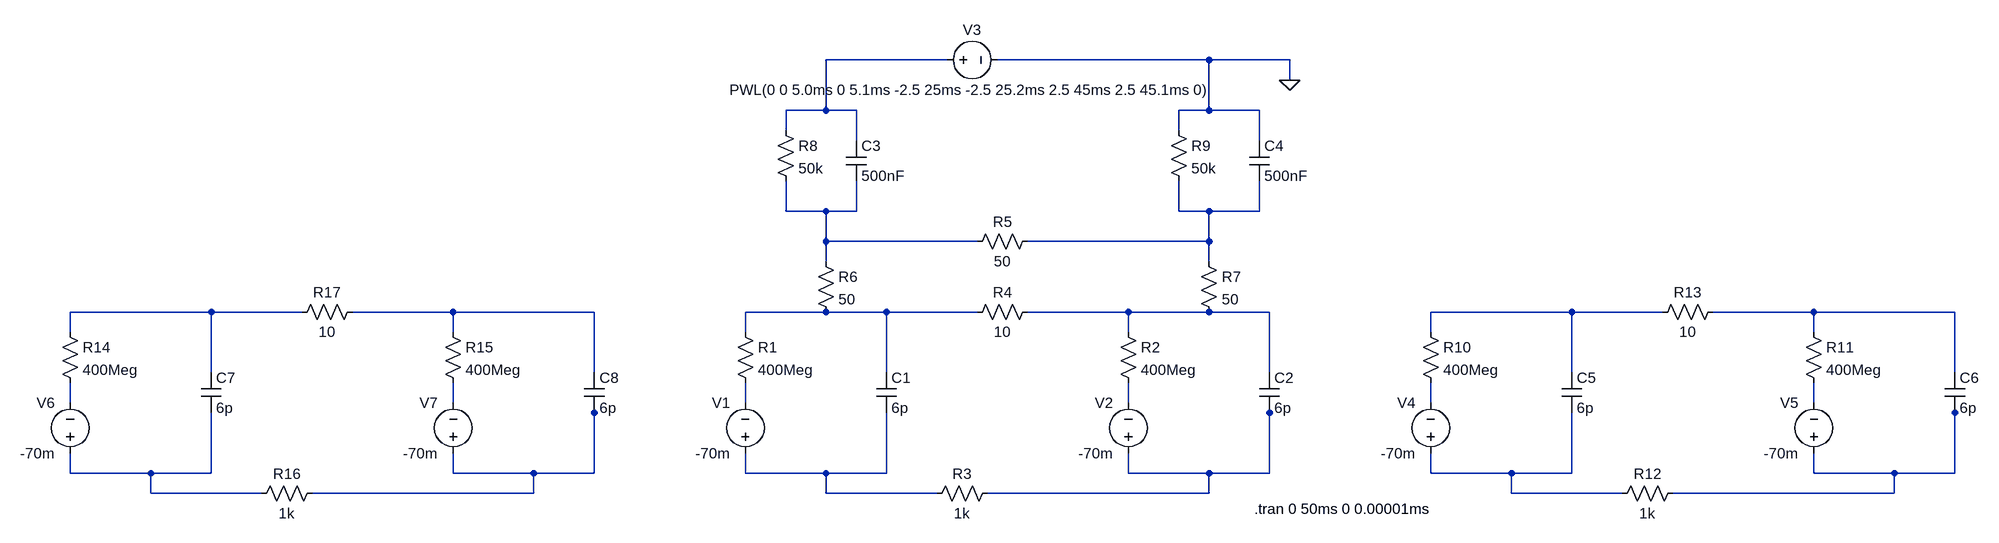
[diagram p0: schematic 電圧刺激等価回路_3cell.asc]
電圧刺激等価回路_3cell.asc, the LTspice schematic file:
Version 4
SHEET 1 1960 680
WIRE 320 -368 128 -368
WIRE 736 -368 400 -368
WIRE 864 -368 736 -368
WIRE 864 -336 864 -368
WIRE 128 -288 128 -368
WIRE 128 -288 64 -288
WIRE 176 -288 128 -288
WIRE 736 -288 736 -368
WIRE 736 -288 688 -288
WIRE 816 -288 736 -288
WIRE 64 -256 64 -288
WIRE 688 -256 688 -288
WIRE 176 -240 176 -288
WIRE 816 -240 816 -288
WIRE 64 -128 64 -176
WIRE 128 -128 64 -128
WIRE 176 -128 176 -176
WIRE 176 -128 128 -128
WIRE 688 -128 688 -176
WIRE 736 -128 688 -128
WIRE 816 -128 816 -176
WIRE 816 -128 736 -128
WIRE 128 -80 128 -128
WIRE 368 -80 128 -80
WIRE 736 -80 736 -128
WIRE 736 -80 448 -80
WIRE 128 -48 128 -80
WIRE 736 -48 736 -80
WIRE -848 32 -1072 32
WIRE -704 32 -848 32
WIRE -464 32 -624 32
WIRE -240 32 -464 32
WIRE 128 32 0 32
WIRE 224 32 128 32
WIRE 368 32 224 32
WIRE 608 32 448 32
WIRE 736 32 608 32
WIRE 832 32 736 32
WIRE 1312 32 1088 32
WIRE 1456 32 1312 32
WIRE 1696 32 1536 32
WIRE 1920 32 1696 32
WIRE -1072 64 -1072 32
WIRE -464 64 -464 32
WIRE 0 64 0 32
WIRE 608 64 608 32
WIRE 1088 64 1088 32
WIRE 1696 64 1696 32
WIRE -848 128 -848 32
WIRE -240 128 -240 32
WIRE 224 128 224 32
WIRE 832 128 832 32
WIRE 1312 128 1312 32
WIRE 1920 128 1920 32
WIRE -1072 176 -1072 144
WIRE -464 176 -464 144
WIRE 0 176 0 144
WIRE 608 176 608 144
WIRE 1088 176 1088 144
WIRE 1696 176 1696 144
WIRE -240 192 -240 176
WIRE 832 192 832 176
WIRE 1920 192 1920 176
WIRE -1072 288 -1072 256
WIRE -944 288 -1072 288
WIRE -848 288 -848 192
WIRE -848 288 -944 288
WIRE -464 288 -464 256
WIRE -336 288 -464 288
WIRE -240 288 -240 192
WIRE -240 288 -336 288
WIRE 0 288 0 256
WIRE 128 288 0 288
WIRE 224 288 224 192
WIRE 224 288 128 288
WIRE 608 288 608 256
WIRE 736 288 608 288
WIRE 832 288 832 192
WIRE 832 288 736 288
WIRE 1088 288 1088 256
WIRE 1216 288 1088 288
WIRE 1312 288 1312 192
WIRE 1312 288 1216 288
WIRE 1696 288 1696 256
WIRE 1824 288 1696 288
WIRE 1920 288 1920 192
WIRE 1920 288 1824 288
WIRE -944 320 -944 288
WIRE -768 320 -944 320
WIRE -336 320 -336 288
WIRE -336 320 -688 320
WIRE 128 320 128 288
WIRE 304 320 128 320
WIRE 736 320 736 288
WIRE 736 320 384 320
WIRE 1216 320 1216 288
WIRE 1392 320 1216 320
WIRE 1824 320 1824 288
WIRE 1824 320 1472 320
FLAG 864 -336 0
SYMBOL voltage 304 -368 R270
WINDOW 0 32 56 VTop 2
WINDOW 3 -32 56 VBottom 2
WINDOW 123 0 0 Left 0
WINDOW 39 0 0 Left 0
SYMATTR InstName V3
SYMATTR Value PWL(0 0 5.0ms 0 5.1ms -2.5 25ms -2.5 25.2ms 2.5 45ms 2.5 45.1ms 0)
SYMBOL res -16 48 R0
SYMATTR InstName R1
SYMATTR Value 400Meg
SYMBOL res 592 48 R0
SYMATTR InstName R2
SYMATTR Value 400Meg
SYMBOL res 400 304 R90
WINDOW 0 0 56 VBottom 2
WINDOW 3 32 56 VTop 2
SYMATTR InstName R3
SYMATTR Value 1k
SYMBOL res 112 -64 R0
SYMATTR InstName R6
SYMATTR Value 50
SYMBOL res 720 -64 R0
SYMATTR InstName R7
SYMATTR Value 50
SYMBOL cap 208 128 R0
SYMATTR InstName C1
SYMATTR Value 6p
SYMBOL cap 816 128 R0
SYMATTR InstName C2
SYMATTR Value 6p
SYMBOL cap 160 -240 R0
SYMATTR InstName C3
SYMATTR Value 500nF
SYMBOL cap 800 -240 R0
SYMATTR InstName C4
SYMATTR Value 500nF
SYMBOL res 48 -272 R0
SYMATTR InstName R8
SYMATTR Value 50k
SYMBOL res 672 -272 R0
SYMATTR InstName R9
SYMATTR Value 50k
SYMBOL voltage 0 272 R180
WINDOW 0 24 96 Left 2
WINDOW 3 24 16 Left 2
SYMATTR InstName V1
SYMATTR Value -70m
SYMBOL voltage 608 272 R180
WINDOW 0 24 96 Left 2
WINDOW 3 24 16 Left 2
SYMATTR InstName V2
SYMATTR Value -70m
SYMBOL res 464 16 R90
WINDOW 0 0 56 VBottom 2
WINDOW 3 32 56 VTop 2
SYMATTR InstName R4
SYMATTR Value 10
SYMBOL res 464 -96 R90
WINDOW 0 0 56 VBottom 2
WINDOW 3 32 56 VTop 2
SYMATTR InstName R5
SYMATTR Value 50
SYMBOL res 1072 48 R0
SYMATTR InstName R10
SYMATTR Value 400Meg
SYMBOL res 1680 48 R0
SYMATTR InstName R11
SYMATTR Value 400Meg
SYMBOL res 1488 304 R90
WINDOW 0 0 56 VBottom 2
WINDOW 3 32 56 VTop 2
SYMATTR InstName R12
SYMATTR Value 1k
SYMBOL cap 1296 128 R0
SYMATTR InstName C5
SYMATTR Value 6p
SYMBOL cap 1904 128 R0
SYMATTR InstName C6
SYMATTR Value 6p
SYMBOL voltage 1088 272 R180
WINDOW 0 24 96 Left 2
WINDOW 3 24 16 Left 2
SYMATTR InstName V4
SYMATTR Value -70m
SYMBOL voltage 1696 272 R180
WINDOW 0 24 96 Left 2
WINDOW 3 24 16 Left 2
SYMATTR InstName V5
SYMATTR Value -70m
SYMBOL res 1552 16 R90
WINDOW 0 0 56 VBottom 2
WINDOW 3 32 56 VTop 2
SYMATTR InstName R13
SYMATTR Value 10
SYMBOL res -1088 48 R0
SYMATTR InstName R14
SYMATTR Value 400Meg
SYMBOL res -480 48 R0
SYMATTR InstName R15
SYMATTR Value 400Meg
SYMBOL res -672 304 R90
WINDOW 0 0 56 VBottom 2
WINDOW 3 32 56 VTop 2
SYMATTR InstName R16
SYMATTR Value 1k
SYMBOL cap -864 128 R0
SYMATTR InstName C7
SYMATTR Value 6p
SYMBOL cap -256 128 R0
SYMATTR InstName C8
SYMATTR Value 6p
SYMBOL voltage -1072 272 R180
WINDOW 0 24 96 Left 2
WINDOW 3 24 16 Left 2
SYMATTR InstName V6
SYMATTR Value -70m
SYMBOL voltage -464 272 R180
WINDOW 0 24 96 Left 2
WINDOW 3 24 16 Left 2
SYMATTR InstName V7
SYMATTR Value -70m
SYMBOL res -608 16 R90
WINDOW 0 0 56 VBottom 2
WINDOW 3 32 56 VTop 2
SYMATTR InstName R17
SYMATTR Value 10
TEXT 808 344 Left 2 !.tran 0 50ms 0 0.00001ms

The netlist it stands for:
* 電圧刺激等価回路_3cell.asc
V3 N001 0 PWL(0 0 5.0ms 0 5.1ms -2.5 25ms -2.5 25.2ms 2.5 45ms 2.5 45.1ms 0)
R1 N006 N012 400Meg
R2 N007 N013 400Meg
R3 N017 N020 1k
R6 N002 N006 50
R7 N003 N007 50
C1 N006 N020 6p
C2 N007 N017 6p
C3 N001 N002 500nF
C4 0 N003 500nF
R8 N001 N002 50k
R9 0 N003 50k
V1 N020 N012 -70m
V2 N017 N013 -70m
R4 N007 N006 10
R5 N003 N002 50
R10 N008 N014 400Meg
R11 N009 N015 400Meg
R12 N018 N021 1k
C5 N008 N021 6p
C6 N009 N018 6p
V4 N021 N014 -70m
V5 N018 N015 -70m
R13 N009 N008 10
R14 N004 N010 400Meg
R15 N005 N011 400Meg
R16 N016 N019 1k
C7 N004 N019 6p
C8 N005 N016 6p
V6 N019 N010 -70m
V7 N016 N011 -70m
R17 N005 N004 10
.tran 0 50ms 0 0.00001ms
.backanno
.end